# EAGLE design MBC1_1-4 (EAGLE 9.6.2)
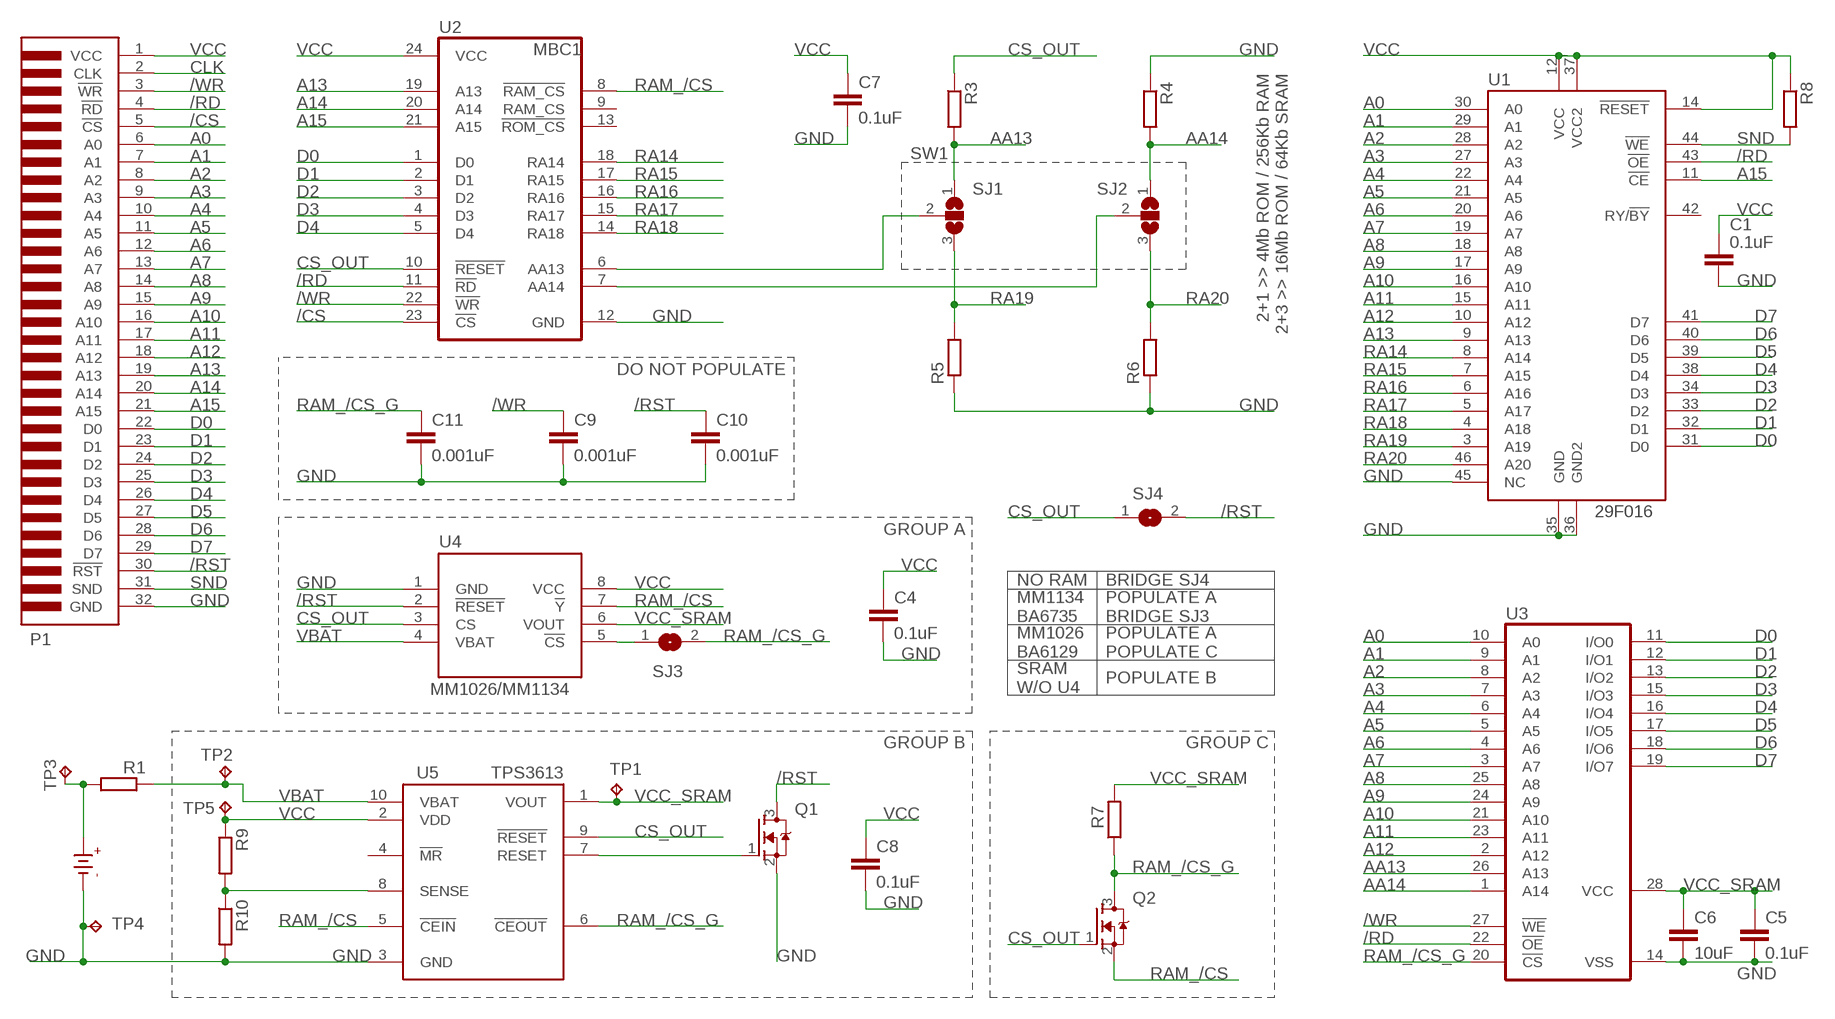
[diagram p0: schematic, sheet 1]

## Parts
B1  CR2025  [CR2025]
C1  0.1uF  C-EUC0603  [C0603]
C4  0.1uF  C-EUC0603  [C0603]
C5  0.1uF  C-EUC0603  [C0603]
C6  10uF  C-EUC0603  [C0603]
C7  0.1uF  C-EUC0603  [C0603]
C8  0.1uF  C-EUC0603  [C0603]
C9  0.001uF  C-EUC0603  [C0603]
C10  0.001uF  C-EUC0603  [C0603]
C11  0.001uF  C-EUC0603  [C0603]
P1  GBC_CARTTAB  [GBC_CART_TABBED]
Q1  2N7002  MOSFET-NREFLOW  [SOT23]
Q2  2N7002  MOSFET-NREFLOW  [SOT23]
R1  RR0603  [R0603]
R3  RR0603  [R0603]
R4  RR0603  [R0603]
R5  RR0603  [R0603]
R6  RR0603  [R0603]
R7  RR0603  [R0603]
R8  RR0603  [R0603]
R9  RR0603  [R0603]
R10  RR0603  [R0603]
SJ1  SJ2W  [SJ_2]
SJ2  SJ2W  [SJ_2]
SJ3  SJ  [SJ]
SJ4  SJ  [SJ]
TP1  TPB1,27  [B1,27]
TP2  TPB1,27  [B1,27]
TP3  TPB1,27  [B1,27]
TP4  TPB1,27  [B1,27]
TP5  TPB1,27  [B1,27]
U1  29F016  [TSOP-48]
U2  MBC1  [SOP-24]
U3  62256_SRAM  [SOP-28L]
U4  MM1134  [SOIC-8]
U5  TPS3613  [MSOP-10]

## Nets
/CS: P1.5(!CS) U2.23(!CS)
/RD: P1.4(!RD) U1.43(!OE) U2.11(!RD) U3.22(!OE)
/RST: C10.1 P1.30(!RST) Q1.3(D) SJ4.2 U4.2(!RESET)
/WR: C9.1 P1.3(!WR) U2.22(!WR) U3.27(!WE)
A0: P1.6(A0) U1.30(A0) U3.10(A0)
A1: P1.7(A1) U1.29(A1) U3.9(A1)
A2: P1.8(A2) U1.28(A2) U3.8(A2)
A3: P1.9(A3) U1.27(A3) U3.7(A3)
A4: P1.10(A4) U1.22(A4) U3.6(A4)
A5: P1.11(A5) U1.21(A5) U3.5(A5)
A6: P1.12(A6) U1.20(A6) U3.4(A6)
A7: P1.13(A7) U1.19(A7) U3.3(A7)
A8: P1.14(A8) U1.18(A8) U3.25(A8)
A9: P1.15(A9) U1.17(A9) U3.24(A9)
A10: P1.16(A10) U1.16(A10) U3.21(A10)
A11: P1.17(A11) U1.15(A11) U3.23(A11)
A12: P1.18(A12) U1.10(A12) U3.2(A12)
A13: P1.19(A13) U1.9(A13) U2.19(A13)
A14: P1.20(A14) U2.20(A14)
A15: P1.21(A15) U1.11(!CE) U2.21(A15)
AA13: R3.2 SJ1.1 U3.26(A13)
AA14: R4.2 SJ2.1 U3.1(A14)
CLK: P1.2(CLK)
CS_OUT: Q2.1(G) R3.1 SJ4.1 U2.10(!RESET) U4.3(CS) U5.9(!RESET)
D0: P1.22(D0) U1.31(D0) U2.1(D0) U3.11(I/O0)
D1: P1.23(D1) U1.32(D1) U2.2(D1) U3.12(I/O1)
D2: P1.24(D2) U1.33(D2) U2.3(D2) U3.13(I/O2)
D3: P1.25(D3) U1.34(D3) U2.4(D3) U3.15(I/O3)
D4: P1.26(D4) U1.38(D4) U2.5(D4) U3.16(I/O4)
D5: P1.27(D5) U1.39(D5) U3.17(I/O5)
D6: P1.28(D6) U1.40(D6) U3.18(I/O6)
D7: P1.29(D7) U1.41(D7) U3.19(I/O7)
GND [GND]: B1.- C1.2 C4.2 C5.2 C6.2 C7.2 C8.2 C9.2 C10.2 C11.2 P1.32(GND) Q1.2(S) R4.1 R5.1 R6.1 R10.2 TP4.TP U1.35(GND) U1.36(GND2) U1.45(NC) U2.12(GND) U3.14(VSS) U4.1(GND) U5.3(GND)
N$1: SJ2.2 U2.7(AA14)
N$2: SJ1.2 U2.6(AA13)
N$3 [VCC]: B1.+ R1.2 TP3.TP
N$4: SJ3.1 U4.5(!CS)
N$6: Q1.1(G) U5.7(RESET)
N$7: R9.2 R10.1 U5.8(SENSE)
RA14: U1.8(A14) U2.18(RA14)
RA15: U1.7(A15) U2.17(RA15)
RA16: U1.6(A16) U2.16(RA16)
RA17: U1.5(A17) U2.15(RA17)
RA18: U1.4(A18) U2.14(RA18)
RA19: R5.2 SJ1.3 U1.3(A19)
RA20: R6.2 SJ2.3 U1.46(A20)
RAM_/CS: Q2.2(S) U2.8(!RAM_CS) U4.7(!Y) U5.5(!CEIN)
RAM_/CS_G: C11.1 Q2.3(D) R7.1 SJ3.2 U3.20(!CS) U5.6(!CEOUT)
SND: P1.31(SND) R8.2 U1.44(!WE)
VBAT [VCC]: R1.1 TP2.TP U4.4(VBAT) U5.10(VBAT)
VCC [VCC]: C1.1 C4.1 C7.1 C8.1 P1.1(VCC) R8.1 R9.1 TP5.TP U1.12(VCC) U1.14(!RESET) U1.37(VCC2) U2.24(VCC) U4.8(VCC) U5.2(VDD)
VCC_SRAM [VCC]: C5.1 C6.1 R7.2 TP1.TP U3.28(VCC) U4.6(VOUT) U5.1(VOUT)
Unconnected: U1.42(RY/!BY) U2.9(RAM_CS) U2.13(!ROM_CS) U5.4(!MR)

## Notes on the sheet
- 2+1 >> 4Mb ROM / 256Kb RAM
  2+3 >> 16Mb ROM / 64Kb SRAM
- SW1
- DO NOT POPULATE
- GROUP A
- NO RAM | BRIDGE SJ4
- MM1134
  BA6735
- POPULATE A
  BRIDGE SJ3
- MM1026
  BA6129
- POPULATE A
  POPULATE C
- SRAM
  W/O U4
- POPULATE B
- MM1026/MM1134
- GROUP B | GROUP C

## Library data of the parts
B1 = gameboylib:CR2025
C1 C4-C11 = rcl:C-EU: CAPACITOR, European symbol; SPICEPREFIX: C
P1 = gameboylib:GBC_CART
Q1 Q2 = adafruit:MOSFET-N: N-Channel Mosfet 2N7002E - 60V 260mA SOT23 [Digikey: 2N7002ET1GOSTR-ND] - REEL BSH103 - 30V 850mA SOT23 [Digikey: 568-5013-1-ND]
R1 R3-R10 = eagle-ltspice:R: RESISTOR, European symbol; SPICEMODEL: NONE; SPICEPREFIX: R
SJ1 SJ2 = jumper:SJ2W: SMD solder JUMPER
SJ3 SJ4 = jumper:SJ: SMD solder JUMPER
TP1-TP5 = testpad:TP: Test pad
U1 = gameboylib:29F016
U2 = gameboy:MBC1: MBC1; OC_FARNELL: unknown; OC_NEWARK: unknown
U3 = gameboylib:62256_SRAM: MEMORY; MPN: CY62256VNLL-70SNXI; OC_FARNELL: 1650073; OC_NEWARK: 19M2582
U4 = gameboylib:MM1134
U5 = gameboylib:TPS3613

## Net classes
1 VCC: width 0.203 mm
2 GND: width 0.203 mm

## Board
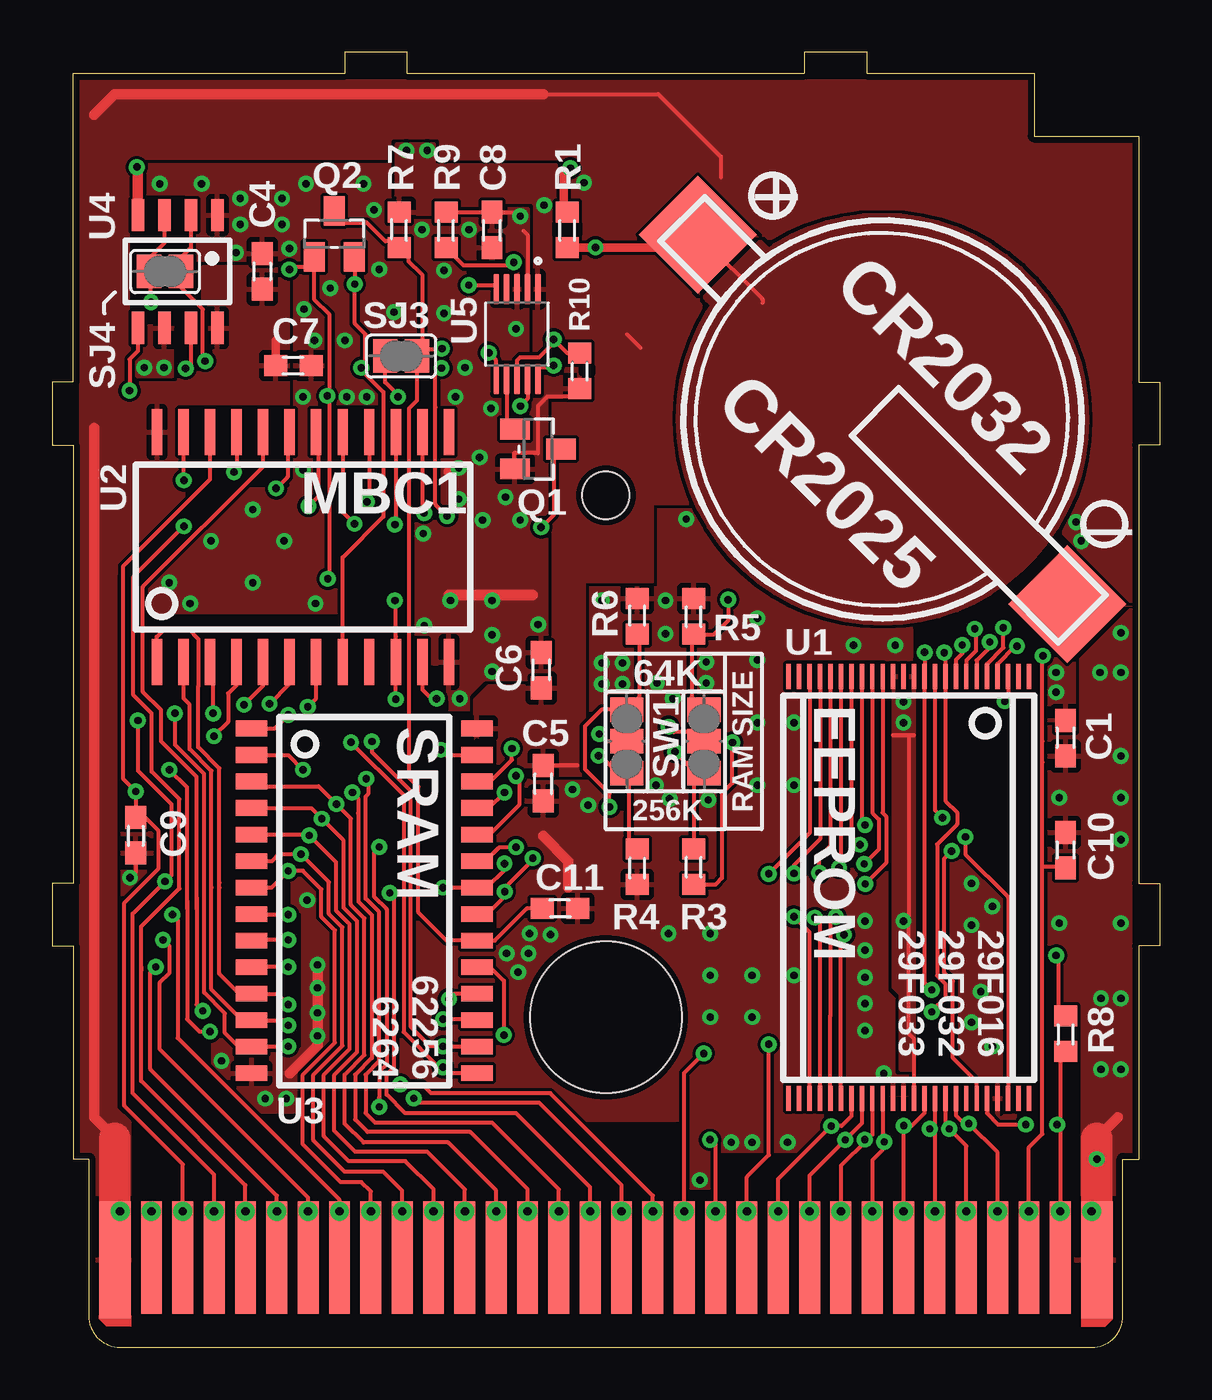
[diagram p1: board, top side]
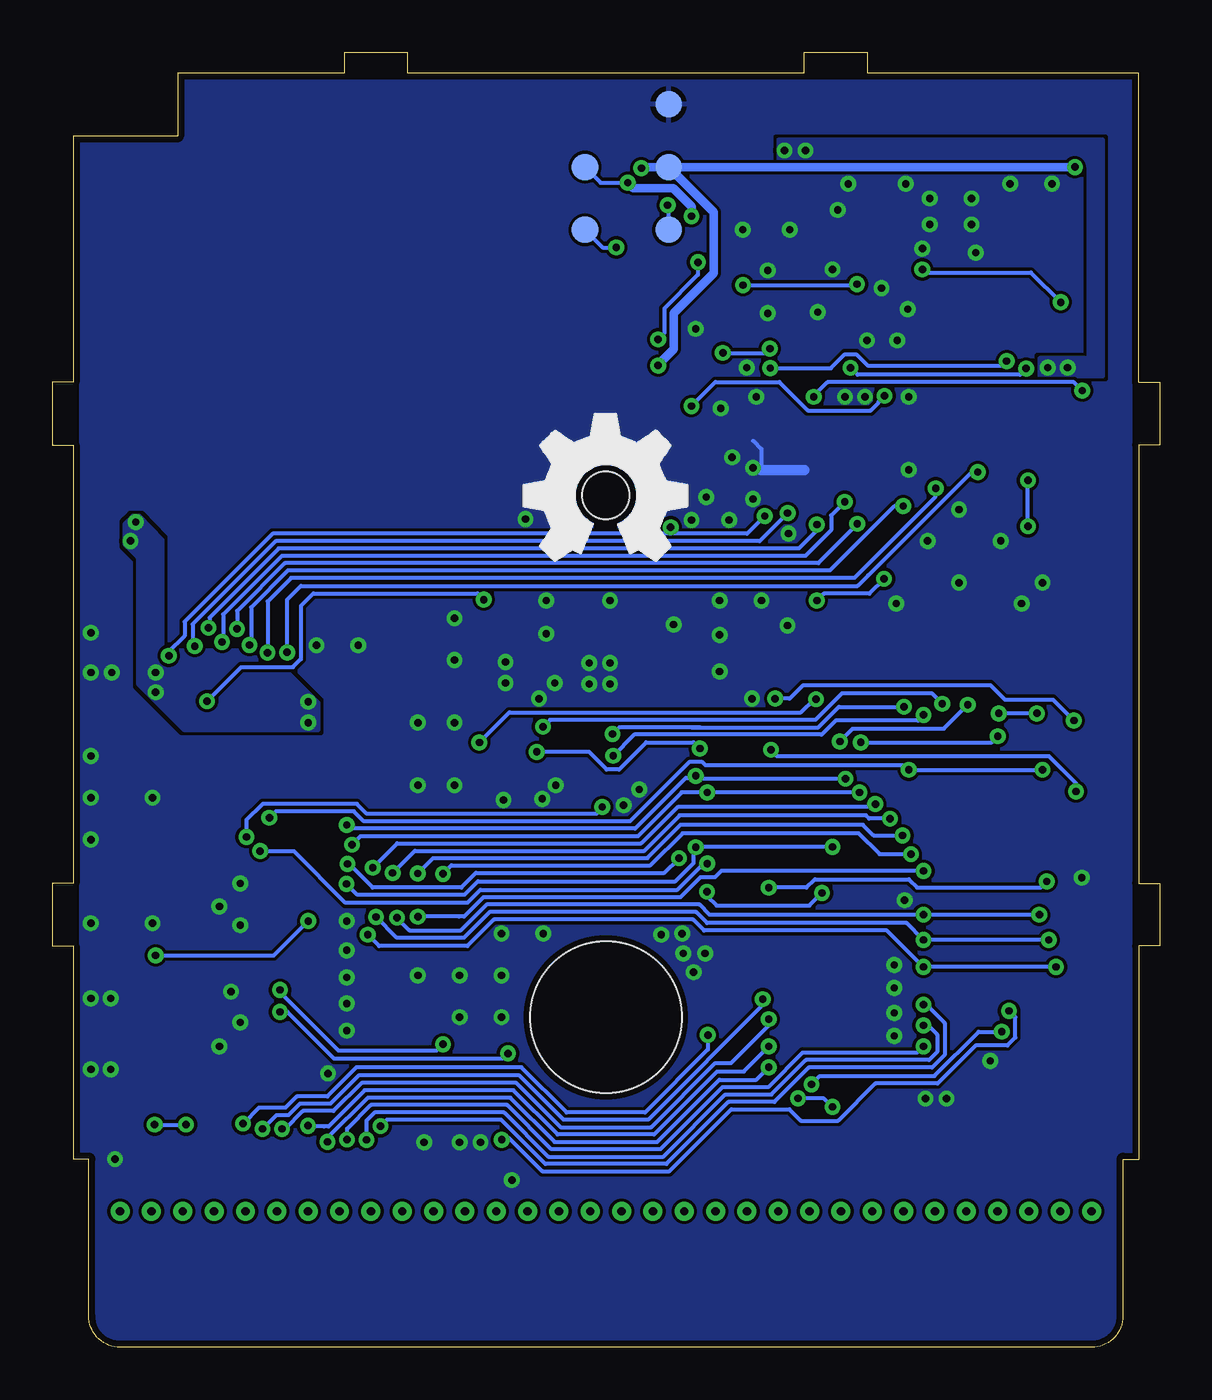
[diagram p2: board, bottom side, seen from below]

Size 53 x 62.01 mm. Coordinates in mm from the lower left corner, seen from the top.
Copper layers (1*16): Top 0.035mm / dielectric 1.5mm / Bottom 0.035mm
Design rules "default *": minimum track width 7mil, minimum drill 13mil, track to track 6mil, track to pad 7mil, pad to pad 7mil, via to via 7mil, smd to smd 5mil, copper to edge 12mil, drill to drill 22mil, minimum pad ring 10mil, minimum via ring 8mil, stop-mask expansion 4mil, vias tented up to drill 14mil, thermal gap 10mil
tKeepout: area -0.8,-1.6 to 55,11.5; area 0,11 to 3,62; area 50,11 to 53,62; area 3,55 to 50,62
tRestrict: area 4.6,34.6 to 14.7,35; area 31.8,8.7 to 35.9,9.2; area 47.6,15.6 to 49,16.2; area 48.9,14.3 to 49.1,15.7; area 48.4,5.5 to 49.1,13.9; area 11.2,14.4 to 11.8,20.7; area 10.6,21 to 11.3,22.4; area 18.8,29.3 to 19.9,30.4; area 35.1,12.1 to 40,12.6; area 35.2,32.3 to 39.8,32.8; area 39.8,11.2 to 41.2,11.9; area 47.6,0.7 to 50.9,1.2; area 20.3,19.9 to 21.1,29.1; area 6,44.7 to 11.3,45; area 8.9,41.3 to 11.2,41.8; area 27.6,6.7 to 35.7,7.5; area 13.7,44.4 to 15.4,45; area 17.5,29.7 to 18.9,31; area 9.8,10.3 to 11.9,11.1; area 6.7,13.5 to 7.5,14.6; area 18.1,31.8 to 18.6,32.6; area 4.5,54.5 to 6.3,55.1; area 25.3,10.2 to 29.9,10.7; area 25.3,46.6 to 25.9,47; area 24,53.3 to 25.3,53.8; area 41.3,33 to 48.9,38.9; area 10.9,60.8 to 42.9,61.3; area 0.7,15 to 1.2,47; area 51.8,14.7 to 52.3,46.7
bRestrict: area 26,39.3 to 27,39.5; area 51.8,14.7 to 52.3,46.7; area 0.7,15 to 1.2,47; area 10.9,60.8 to 42.9,61.3

### Footprints (pad centres in the part's own frame; a part is rotated, then mirrored left to right if it is on the bottom)
CR2025 = smd 4 x 4: + -12,0; - 13,0
C0603 = smd 1.1 x 1: 1 -0.85,0; 2 0.85,0
GBC_CART_TABBED = smd 1.5 x 5.6: 1 -23.4,-25.01; 32 23.6,-25.01 | smd 1 x 5.4: 2 -21.65,-24.91; 3 -20.15,-24.91; 4 -18.65,-24.91; 5 -17.15,-24.91; 6 -15.65,-24.91; 7 -14.15,-24.91; 8 -12.65,-24.91; 9 -11.15,-24.91; 10 -9.65,-24.91; 11 -8.15,-24.91; 12 -6.65,-24.91; 13 -5.15,-24.91; 14 -3.65,-24.91; 15 -2.15,-24.91; 16 -0.65,-24.91; 17 0.85,-24.91; 18 2.35,-24.91; 19 3.85,-24.91; 20 5.35,-24.91; 21 6.85,-24.91; 22 8.35,-24.91; 23 9.85,-24.91; 24 11.35,-24.91; 25 12.85,-24.91; 26 14.35,-24.91; 27 15.85,-24.91; 28 17.35,-24.91; 29 18.85,-24.91; 30 20.35,-24.91; 31 21.85,-24.91 | drill 0.4: P$1 -21.65,-22.7; P$2 -18.65,-22.7; P$3 -15.65,-22.7; P$4 -12.65,-22.7; P$5 -9.65,-22.7; P$6 -6.65,-22.7; P$7 -3.65,-22.7; P$8 -0.65,-22.7; P$9 2.35,-22.7; P$10 5.35,-22.7; P$11 8.35,-22.7; P$12 11.35,-22.7; P$13 14.35,-22.7; P$14 17.35,-22.7; P$15 20.35,-22.7; P$16 23.35,-22.7; P$17 21.85,-22.7; P$18 18.85,-22.7; P$19 15.85,-22.7; P$20 12.85,-22.7; P$21 9.85,-22.7; P$22 6.85,-22.7; P$23 3.85,-22.7; P$24 0.85,-22.7; P$25 -2.15,-22.7; P$26 -5.15,-22.7; P$27 -8.15,-22.7; P$28 -11.15,-22.7; P$29 -14.15,-22.7; P$30 -17.15,-22.7; P$31 -20.15,-22.7; P$32 -23.15,-22.7 | hole 7.25: 0.1,-13.41 | hole 2.25: 0.1,11.585
SOT23 = smd 1 x 1.4: 1 -0.95,-1.1; 2 0.95,-1.1; 3 0,1.1
R0603 = smd 1 x 1.1: 1 -0.85,0; 2 0.85,0
SJ_2 = smd 1.168 x 1.6: 1 -1.524,0; 2 0,0; 3 1.524,0
SJ = smd 1.168 x 1.6: 1 -0.762,0; 2 0.762,0
B1,27 = smd 1.27 x 1.27: TP 0,0
TSOP-48 = smd 1.2 x 0.21: 1 -10.1,5.75; 2 -10.1,5.25; 3 -10.1,4.75; 4 -10.1,4.25; 5 -10.1,3.75; 6 -10.1,3.25; 7 -10.1,2.75; 8 -10.1,2.25; 9 -10.1,1.75; 10 -10.1,1.25; 11 -10.1,0.75; 12 -10.1,0.25; 13 -10.1,-0.25; 14 -10.1,-0.75; 15 -10.1,-1.25; 16 -10.1,-1.75; 17 -10.1,-2.25; 18 -10.1,-2.75; 19 -10.1,-3.25; 20 -10.1,-3.75; 21 -10.1,-4.25; 22 -10.1,-4.75; 23 -10.1,-5.25; 24 -10.1,-5.75; 25 10.1,-5.75; 26 10.1,-5.25; 27 10.1,-4.75; 28 10.1,-4.25; 29 10.1,-3.75; 30 10.1,-3.25; 31 10.1,-2.75; 32 10.1,-2.25; 33 10.1,-1.75; 34 10.1,-1.25; 35 10.1,-0.75; 36 10.1,-0.25; 37 10.1,0.25; 38 10.1,0.75; 39 10.1,1.25; 40 10.1,1.75; 41 10.1,2.25; 42 10.1,2.75; 43 10.1,3.25; 44 10.1,3.75; 45 10.1,4.25; 46 10.1,4.75; 47 10.1,5.25; 48 10.1,5.75
SOP-24 = smd 0.5 x 2.2: 1 -6.985,-5.5; 2 -5.715,-5.5; 3 -4.445,-5.5; 4 -3.175,-5.5; 5 -1.905,-5.5; 6 -0.635,-5.5; 7 0.635,-5.5; 8 1.905,-5.5; 9 3.175,-5.5; 10 4.445,-5.5; 11 5.715,-5.5; 12 6.985,-5.5; 13 6.985,5.5; 14 5.715,5.5; 15 4.445,5.5; 16 3.175,5.5; 17 1.905,5.5; 18 0.635,5.5; 19 -0.635,5.5; 20 -1.905,5.5; 21 -3.175,5.5; 22 -4.445,5.5; 23 -5.715,5.5; 24 -6.985,5.5
SOP-28L = smd 0.75 x 1.5: 1 -7.62,-5.457; 2 -6.35,-5.457; 3 -5.08,-5.457; 4 -3.81,-5.457; 5 -2.54,-5.457; 6 -1.27,-5.457; 7 0,-5.457; 8 1.27,-5.457; 9 2.54,-5.457; 10 3.81,-5.457; 11 5.08,-5.457; 12 6.35,-5.457; 13 7.62,-5.457; 14 8.89,-5.457; 15 8.89,5.33; 16 7.62,5.33; 17 6.35,5.33; 18 5.08,5.33; 19 3.81,5.33; 20 2.54,5.33; 21 1.27,5.33; 22 0,5.33; 23 -1.27,5.33; 24 -2.54,5.33; 25 -3.81,5.33; 26 -5.08,5.33; 27 -6.35,5.33; 28 -7.62,5.33
SOIC-8 = smd 0.6 x 1.55: 1 1.905,2.7; 2 0.635,2.7; 3 -0.635,2.7; 4 -1.905,2.7; 5 -1.905,-2.7; 6 -0.635,-2.7; 7 0.635,-2.7; 8 1.905,-2.7
MSOP-10 = smd 1.47 x 0.28: 1 -2.15,1; 2 -2.15,0.5; 3 -2.15,0; 4 -2.15,-0.5; 5 -2.15,-1; 6 2.15,-1; 7 2.15,-0.5; 8 2.15,0; 9 2.15,0.5; 10 2.15,1

### Placement (x,y rotation side)
B1  39.39,44.79 315 top
C1  48.5,29.16 270 top
C4  10.05,51.51 90 top
C5  23.5,27.01 270 top
C6  23.4,32.41 90 top
C7  11.55,47.01 0 top
C8  21.05,53.51 270 top
C9  4,24.51 270 top
C10  48.5,23.81 90 top
C11  24.3,21.01 0 top
P1  26.4,29.21 0 top
Q1  23.25,43.01 270 top
Q2  13.5,53.31 0 top
R1  24.65,53.51 270 top
R3  30.7,23.01 90 top
R4  28,23.01 90 top
R5  30.7,35.01 270 top
R6  28,35.01 270 top
R7  16.6,53.51 90 top
R8  48.5,15.01 270 top
R9  18.85,53.51 270 top
R10  25.25,46.76 270 top
SJ1  31.2,29.01 90 top
SJ2  27.5,29.01 90 top
SJ3  16.7,47.46 0 top
SJ4  5.4,51.51 0 top
TP1  23.5,53.51 0 bottom
TP2  23.5,56.51 0 bottom
TP3  27.5,53.51 0 bottom
TP4  23.5,59.51 0 bottom
TP5  27.5,56.51 0 bottom
U1  41,22.01 270 top
U2  12,38.31 0 top
U3  15,22.01 270 top
U4  6,51.51 0 top
U5  22.25,48.51 270 top

### Tracks (layer width: path | path; a pad name or v marks a point on that pad's centre or on a via)
/CS  (via drill 0.35)
  Top 0.2: P1.5 9.25,7.76 4.8,12.21 | v6.3,39.31 3.89,36.9 3.89,31.22 4.76,30.35 | v6.3,41.51 6.3,43.8 U2.23 | 4.25,18.01 4.25,20.14 6.08,21.97 6.08,26.24 4.76,27.57
  Top 0.203: 4.8,12.21 4.25,12.76 4.25,18.01 4.25,18.23 | 4.76,27.57 4.76,30.35
  Bottom 0.2: v6.3,39.31 v6.3,41.51
/RD  (via drill 0.35)
  Top 0.2: P1.4 7.75,8.26 3.85,12.16 3.85,20.76 v5.4,22.31 5.7,22.61 5.7,26.01 4.1,27.61 v4.1,30.01 | v18.7,22.01 U3.22 20.8,22.01 21.65,22.86 v21.65,23.16 | U2.11 17.71,31.5 18.15,31.06 v18.4,31.06 | v43.05,23.76 42.7,23.42 42.7,17.93 43.11,17.53 43.11,13.85 44.25,12.71
  Top 0.203: U1.43 44.25,12.71
  Bottom 0.2: v18.7,22.01 16.9,22.01 16.5,22.41 12,22.41 11.6,22.01 5.7,22.01 v5.4,22.31 | v4.1,30.01 5.1,31.01 7.4,31.01 8.1,31.71 17.05,31.71 17.7,31.06 v18.4,31.06 | v43.05,23.76 41.45,23.76 38.97,21.28
  Bottom 0.203: v21.65,23.16 21.83,23.16 23.08,21.91 32.51,21.91 33.13,21.28 35.23,21.28 35.77,21.28 38.97,21.28
/RST  (via drill 0.35)
  Top 0.2: 47.39,28.01 47.39,10.21 46.75,9.57 P1.30 | 47.39,23.01 47.39,29.01 47.39,33.09 v47.42,33.11 | U4.2 6.63,52.64 6.08,52.09 6.08,51.43 6.08,50.83 7.21,49.7 7.21,47.32 v7.32,47.22 | 18.34,45 18.34,46.59 v18.63,46.88
  Top 0.203: 47.39,28.01 47.39,29.01 | C10.1 48.5,23.01 47.39,23.01 | SJ4.2 6.08,51.43 6.07,51.41 | U4.2 6.6,54.21 | v18.9,39.8 18.34,40.35 18.34,45 | Q1.3 24.15,43.01 24,42.86 24,39.86 v23.4,39.26
  Bottom 0.2: v18.63,46.88 15.73,46.88 15.06,47.55 14.52,47.55 13.97,47.01 7.53,47.01 v7.32,47.22 | v18.9,39.8 19.75,38.95 23.4,38.95 | 23.4,38.95 42.46,38.95 46.67,34.74 46.67,34.06 47.42,33.31 v47.42,33.11 | v23.4,39.26 23.4,38.95
  Bottom 0.203: 23.4,38.96 v23.4,39.26
/WR  (via drill 0.35)
  Top 0.2: P1.3 6.25,8.76 3.45,11.56 3.45,21.29 5.1,22.94 5.1,24.71 4.45,25.36 C9.1 v4,26.61 3.4,27.21 3.4,37.41 7.55,41.56 U2.22 | v18.6,28.61 18.85,28.36 U3.27
  Bottom 0.2: v18.6,28.61 18.3,28.31 5.3,28.31 4,27.01 v4,26.61
A0  (via drill 0.35)
  Top 0.2: P1.6 10.75,7.26 4.7,13.31 4.7,17.95 v4.96,18.21 | v11.3,18.21 9.8,18.21 U3.10 | 37.75,19.6 v37.9,19.75
  Top 0.203: U1.30 37.75,19.6
  Bottom 0.2: v4.96,18.21 v11.3,18.21
  Bottom 0.203: v11.3,18.21 13.04,19.95 21.8,19.95 22.33,20.48 31.86,20.48 33.13,19.21 37.36,19.21 v37.9,19.75
A1  (via drill 0.35)
  Top 0.2: P1.7 12.25,7.16 5.7,13.71 | v11.3,19.51 9.83,19.51 U3.9 | v37.5,20.61 37.24,20.35 37.24,15.88
  Top 0.203: 5.7,13.71 5.15,14.26 5.15,17.48 5.61,17.94 5.61,19.2 v5.3,19.51 | U1.29 37.25,15.88 37.24,15.88
  Bottom 0.2: v5.3,19.51 v11.3,19.51 | 36.5,19.61 v37.5,20.61
  Bottom 0.203: v11.3,19.51 12.1,20.31 21.65,20.31 22.18,20.84 32.07,20.84 33.3,19.61 36.5,19.61
A2  (via drill 0.35)
  Top 0.2: P1.8 13.75,7.06 6,14.81 6,20.46 v5.75,20.71 | v11.3,20.71 9.82,20.71 U3.8 | 36.75,20.38 36.56,20.57 v36.5,20.57
  Top 0.203: U1.28 36.75,20.38
  Bottom 0.2: v5.75,20.71 v11.3,20.71 21.53,20.71 | v36.5,20.57 35.9,19.97 33.44,19.97
  Bottom 0.203: 33.44,19.97 32.21,21.19 22.02,21.19 21.53,20.71
A3  (via drill 0.35)
  Top 0.2: P1.9 15.25,7.46 14.8,7.91 13.8,7.91 12,9.71 12,13.05 13.53,14.58 13.53,19.96 12.89,20.61 12.89,21.92 12,22.81 v11.3,22.81 10.5,22.01 U3.7 | v35.5,20.62 36.06,20.07
  Top 0.203: U1.27 36.25,19.87 36.06,20.07
  Bottom 0.2: v11.3,22.81 20.9,22.81 | 33.54,20.62 v35.5,20.62 | 20.97,22.81 21.28,22.5 21.98,22.5 22.94,21.55 32.36,21.55
  Bottom 0.203: 20.9,22.81 20.97,22.81 | 32.36,21.55 33.29,20.62 33.54,20.62
A4  (via drill 0.35)
  Top 0.2: P1.10 16.75,7.5 15.84,8.41 14,8.41 12.5,9.91 12.5,13.05 13.89,14.43 13.89,20.11 13.24,20.75 13.24,22.27 v11.9,23.61 10.85,23.61 10.52,23.28 U3.6 | v34.3,22.67 36.25,24.62 U1.22
  Bottom 0.2: v11.9,23.61 13.4,23.61 14.4,24.61 22.83,24.61 24.37,23.07 33.9,23.07 v34.3,22.67
A5  (via drill 0.35)
  Top 0.2: P1.11 18.25,7.56 16.9,8.91 14.2,8.91 13,10.11 13,13.05 14.24,14.29 14.24,20.25 13.59,20.9 13.59,23.22 v12.3,24.51 12.26,24.55 U3.5 | v35.51,22.69 35.51,23.09 36.72,24.3 36.75,24.33 U1.21
  Bottom 0.2: v12.3,24.51 13.7,24.51 14.2,25.01 22.93,25.01 24.52,23.42 34.77,23.42 v35.51,22.69
A6  (via drill 0.35)
  Top 0.2: P1.12 19.75,7.56 17.95,9.36 14.5,9.36 13.5,10.36 13.5,13.05 14.59,14.14 14.59,20.4 13.94,21.05 13.94,24.27 v12.9,25.31 12.39,25.82 U3.4 | v36.71,22.71 36.71,23.46 37.13,23.88 37.25,24 U1.20
  Bottom 0.2: v12.9,25.31 13.9,25.31 14.06,25.47 22.97,25.47 24.66,23.78 35.64,23.78 v36.71,22.71
A7  (via drill 0.35)
  Top 0.2: P1.13 21.25,7.51 18.95,9.81 14.9,9.81 14,10.71 14,13.05 14.94,14 14.94,20.54 14.29,21.19 14.29,25.32 v13.6,26.01 12.75,26.86 9.77,26.86 U3.3 | v37.66,22.96 37.75,23.05 U1.19
  Bottom 0.2: v13.6,26.01 13.74,25.87 23.07,25.87 24.81,24.13 36.49,24.13 v37.66,22.96
A8  (via drill 0.35)
  Top 0.2: P1.14 22.75,7.56 20,10.31 15.1,10.31 14.5,10.91 14.5,13.05 15.29,13.85 15.29,20.69 14.65,21.34 14.65,25.56 14.65,26.29 v14.37,26.57 | U3.25 20.9,25.82 v21.65,26.57 | v38.66,24.06 38.25,24.47 U1.18
  Bottom 0.2: 21,26.57 22.87,26.57 24.95,24.48 38.23,24.48 v38.66,24.06
  Bottom 0.203: v14.37,26.57 21,26.57 v21.65,26.57
A9  (via drill 0.35)
  Top 0.2: P1.15 24.25,7.56 21.05,10.76 15.45,10.76 | U3.24 20.94,24.55 22.35,25.96 22.35,27.21 v22.2,27.36 | v38.91,25.01 38.75,25.17 U1.17 | 15,11.24 15,13.06 15.65,13.7 15.65,20.84 15,21.48 15,26.01
  Top 0.203: 15,25.71 15,26.01 15,26.37 15.12,26.49 15.12,27.13 v15.03,27.22 | 15,11.24 15,11.21 15.45,10.76
  Bottom 0.2: v22.2,27.36 22.3,27.26 22.67,27.26 25.1,24.83 38.73,24.83 v38.91,25.01
  Bottom 0.203: v15.03,27.22 22.06,27.22 v22.2,27.36
A10  (via drill 0.35)
  Top 0.2: P1.16 25.75,7.66 22.2,11.21 16.9,11.21 16,12.11 16,13.06 16.36,13.42 16.36,21.55 v16.16,21.75 | U3.21 20.09,20.75 20.82,20.75 21.66,21.6 | v23,23.42 23,23.13 22.8,23.13 21.62,21.95 | v38.86,23.15 39.56,23.85 39.56,25.28 39.25,25.59 U1.16
  Top 0.203: 21.62,21.95 v21.66,21.82 21.66,21.6
  Bottom 0.2: v23,23.42 23.7,22.72 32.72,22.72 33.42,22.02 37.66,22.02 38.79,23.15 v38.86,23.15
  Bottom 0.203: v16.16,21.75 16.76,21.15 21.2,21.15 21.66,21.62 v21.66,21.82
A11  (via drill 0.35)
  Top 0.2: P1.17 27.25,7.76 23.3,11.71 17.51,11.71 v17.31,11.92 | U3.23 20.74,23.28 21.38,23.92 | v38.92,22.18 39.91,23.18 39.91,25.43 39.75,25.59 U1.15 | v15.66,23.95 15.66,23.93 15.4,23.68 15.4,21.58 16,20.98 16,13.56 15.65,13.21 15.65,11.96 15.66,11.96 v15.66,11.51
  Top 0.203: v22.2,23.94 21.4,23.94 20.74,23.28 U3.23
  Bottom 0.2: v15.66,11.51 16.06,11.92 v17.31,11.92 | v38.92,22.18 38.4,21.66 33.27,21.66 32.62,22.32 23.17,22.32 22.31,23.18 22.31,23.68 22.2,23.79 v22.2,23.94
  Bottom 0.203: v15.66,23.95 v15.66,23.96 22.19,23.96 v22.2,23.94
A12  (via drill 0.35)
  Top 0.2: P1.18 28.75,7.26 23.85,12.16 18.13,12.16 17.7,12.59 v16.66,12.59 | v7.56,15.11 7.06,15.11 | U3.2 11.29,28.36 v12,27.65 | v42.61,25.36 42.25,25.72 U1.10 | v5.61,27.65 6.45,26.81 6.45,21.01
  Top 0.203: 7.06,15.11 6.45,15.71 6.45,21.01 6.45,21.39
  Bottom 0.2: v16.66,12.59 16.26,12.99 10.78,12.99 8.66,15.11 v7.56,15.11 | 12.23,27.88 v12,27.65 v5.61,27.65 | 25.35,25.19 22.52,28.02 21.88,28.02
  Bottom 0.203: 21.88,28.02 21.74,27.88 12.23,27.88 | v42.61,25.36 42.3,25.67 38.56,25.67 38.08,25.19 25.35,25.19
A13  (via drill 0.35)
  Top 0.2: P1.19 30.25,13.13 v31.18,14.07 | v42.1,16.06 42.1,16.1 42.76,16.75 42.76,17.38 42.35,17.79 42.35,24.09 43.31,25.04 43.31,25.61 42.75,26.17 U1.9 42.75,33.2
  Top 0.203: v10.71,41.12 11.27,41.67 11.27,43.21 11.37,43.31 U2.19 | v42.69,33.26 42.75,33.2
  Bottom 0.2: v31.18,14.07 31.44,13.81 39.5,13.81 41.75,16.06 v42.1,16.06 | 10.71,40.75 14.62,36.84 41.57,36.84 42.69,35.72 v42.69,33.26
  Bottom 0.203: 10.71,40.75 v10.71,41.12
A14  (via drill 0.35)
  Top 0.2: 6.91,16.41 v7.21,16.11 | 5.21,30.51 5.21,29.01 6.91,27.32 6.91,21.01
  Top 0.203: P1.20 31.75,9.94 v31.48,9.94 | 6.91,21.54 6.91,21.01 6.91,16.41 | 5.21,30.51 4.34,31.38 4.34,36.42 10.1,42.17 U2.20
  Bottom 0.2: 13.6,12.63 10.63,12.63 8.81,14.45 7.28,14.45 6.9,14.84 6.9,15.8 v7.21,16.11 | v31.48,9.94 31.41,10.01 31.13,10.01 29.54,8.43 23.46,8.43 20.49,11.4 17.71,11.4
  Bottom 0.203: 13.6,12.63 15.38,10.85 17.17,10.85 17.71,11.4
A15  (via drill 0.35)
  Top 0.2: P1.21 33.25,8.16 34.3,9.21 v34.3,14.51 | v42.1,17.11 41.75,17.46 U1.11 v41.76,33.27
  Top 0.203: U2.21 8.82,42.03 v8.7,41.91 | v41.75,33.26 v41.76,33.27
  Bottom 0.2: v42.1,17.11 42.1,17.01 39.3,14.21 34.6,14.21 v34.3,14.51 | v41.76,33.27 v41.75,33.28 41.75,35.8 41.1,36.45 14.45,36.45 13.95,36.96
  Bottom 0.203: 13.95,36.95 13.95,36.96 9,41.91 v8.7,41.91
AA13  (via drill 0.35)
  Top 0.2: v29.81,28.51 30.83,27.49 SJ1.1 30.7,26.99 R3.2
  Top 0.203: U3.26 20.97,27.09 22,28.12 v22,28.67
  Bottom 0.2: v22,28.67 22.29,28.97 24.57,28.97 25.87,27.67 26.46,27.67 27.31,28.51 v29.81,28.51
AA14  (via drill 0.35)
  Top 0.2: 26.26,28.32 27.1,27.49 SJ2.1
  Top 0.203: U3.1 10.65,29.63 v11.3,30.28 | SJ2.1 27.6,27.39 27.6,24.26 R4.2 | 26.26,28.32 v26.15,28.32
  Bottom 0.203: v11.3,30.28 11.57,30.01 15.5,30.01 16.18,29.33 25.14,29.33 v26.15,28.32
CS_OUT  (via drill 0.35)
  Top 0.2: U2.10 16.45,34.01 | 16.45,34.01 16.45,35.85 16.4,35.85 v16.4,35.75 | v13.18,36.79 13.27,36.79 13.27,45.51 | 13.27,45.51 13.27,49.44 12.55,50.16 12.55,51.96 | v16.44,31.03 16.44,34.01 16.45,34.01 | R3.1 31.75,22.16 32.06,22.47 32.06,26.51 32.56,27.01 v32.56,28.96 | U4.3 5.37,52.88 4.64,52.15 SJ4.1 | v4.73,50.04 4.71,50.06 4.71,51.44 | v11.35,51.61 11.45,51.71 12.3,51.71 12.55,51.96 | Q2.1 12.55,51.96 | U5.9 22.75,45.41 v22.41,45.07 | v13.17,45.55 13.23,45.55 13.27,45.51
  Top 0.203: 4.64,51.11 SJ4.1 4.71,51.44
  Bottom 0.2: v11.35,51.61 11.2,51.46 6.16,51.46 v4.73,50.04 | v16.44,31.03 16.53,31.03 17.16,30.4 31.12,30.4 v32.56,28.96 | v16.4,35.75 16.07,36.09 13.89,36.09 v13.18,36.79 | v22.41,45.07 21.26,46.22 18.19,46.22 16.83,44.85 13.83,44.85 13.44,45.24 13.44,45.28 v13.17,45.55
D0  (via drill 0.35)
  Top 0.2: U3.11 10.78,16.93 v11.3,16.41 | P1.22 34.75,8.06 v37.28,10.59 v37.29,10.59 37.78,10.59 38.25,11.06 | 6.99,31.65 6.98,31.65 | 6.99,31.65 6.99,28.74 8,27.72 8,22.01 | U2.1 5,32.83 5,34.01 5.4,34.41 6.5,34.41 7,33.91 7,31.66 6.99,31.65
  Top 0.203: U3.11 8.95,16.93 8,17.88 8,22.01 8,22.25 | 5.01,32.7 U2.1 | U1.31 38.25,11.06
  Bottom 0.2: v11.3,16.41 11.17,16.41 10.29,15.53 10.29,13.99 10.88,13.4 16.78,13.4 18.44,11.75 20.63,11.75 23.6,8.78 29.4,8.78 31.51,10.9 36.99,10.9 v37.29,10.59
D1  (via drill 0.35)
  Top 0.2: U3.12 11.05,15.66 v11.3,15.41 | P1.23 36.25,8.22 v37.96,9.93 v37.96,9.94 38.75,10.73 | 6.58,30.78 6.58,28.65 7.62,27.61 7.62,22.01
  Top 0.203: U3.12 9.09,15.66 7.62,17.13 7.62,22.01 7.62,22.03 | 6.58,30.78 6.29,31.07 U2.2 | U1.32 38.75,10.73
  Bottom 0.2: v11.3,15.41 11.07,15.41 10.64,14.98 10.64,14.14 11.03,13.75 16.93,13.75 18.58,12.1 20.78,12.1 23.75,9.13 29.25,9.13 31.37,11.25 37.56,11.25 37.95,10.86 37.95,9.95 v37.96,9.94
D2  (via drill 0.35)
  Top 0.2: P1.24 37.75,8.69 39,9.94 | U3.13 11.28,14.39 v11.3,14.41 | 39.25,10.19 39,9.94 | 39,9.94 v38.89,9.94 | v5.87,30.35 5.87,28.86 7.26,27.46 7.26,21.78
  Top 0.203: U3.13 8.92,14.39 8.27,15.04 8.27,15.98 7.26,16.98 7.26,21.78 | v7.7,30.35 7.7,32.81 U2.3 | U1.33 39.25,10.19
  Bottom 0.2: v11.3,14.41 11.6,14.11 17.07,14.11 18.73,12.45 20.93,12.45 23.9,9.48 29.1,9.48 31.22,11.6 37.75,11.6 38.89,10.46 v38.89,9.94
  Bottom 0.203: v5.87,30.35 v7.7,30.35
D3  (via drill 0.35)
  Top 0.2: U3.15 18.99,13.12 v18.7,13.41 | P1.25 39.25,8.96 39.75,9.46 39.75,9.91 v39.83,9.84 | 18.5,13.41 16.81,15.1 16.81,26.45
  Top 0.203: v18.7,13.41 18.5,13.41 | 16.81,26.45 v14.3,28.97 | v7.74,29.26 8.43,29.94 8.43,31.31 8.82,31.71 U2.4 | U1.34 39.75,9.91
  Bottom 0.2: v18.7,13.41 19.3,12.81 21.07,12.81 24.04,9.84 28.96,9.84 31.08,11.95 37.9,11.95 39.83,10.02 v39.83,9.84
  Bottom 0.203: v14.3,28.97 8.04,28.97 v7.74,29.26
D4  (via drill 0.35)
  Top 0.2: U3.16 18.72,14.39 v18.7,14.41
  Top 0.203: v18.7,14.41 18.1,14.41 17.17,15.34 17.17,26.64 15.3,28.51 v15.3,29.01 | v9.18,30.77 10.1,31.68 U2.5 | P1.26 v40.75,10.6 v40.76,10.61 41.15,10.61 41.75,11.21 U1.38
  Bottom 0.2: v18.7,14.41 19.9,13.21 21.17,13.21 24.19,10.19 28.81,10.19 30.93,12.31 38.04,12.31 | 38.04,12.31 | 38.04,12.31 39.77,10.58 40,10.58
  Bottom 0.203: v15.3,29.01 14.69,29.62 10.33,29.62 v9.18,30.77 | v40.76,10.61 40.73,10.58 40,10.58 39.77,10.58
D5  (via drill 0.35)
  Top 0.2: U3.17 20.03,15.71 v18.7,15.71
  Top 0.203: P1.27 42.25,10.21 v42,10.46 42.06,10.46 42.25,10.65 U1.39
  Bottom 0.2: v18.7,15.71 18.7,15.41 20.5,13.61 21.26,13.61 24.33,10.54 28.67,10.54 30.78,12.66 38.19,12.66 39.54,11.31 41,11.31 41.85,10.46 v42,10.46
D6  (via drill 0.35)
  Top 0.2: U3.18 19.25,16.93 v18.99,16.67 | 42.75,10.64 v42.93,10.46 43.75,9.64 P1.28
  Top 0.203: U1.40 42.75,10.64
  Bottom 0.2: v18.99,16.67 18.85,16.53 24.48,10.89 28.52,10.89 30.64,13.01 38.34,13.01 39.69,11.66 41.15,11.66 41.69,11.12 42.27,11.12 v42.93,10.46
D7  (via drill 0.35)
  Top 0.2: 45.23,4.92 45.25,4.9 P1.29 45.25,9.33 v43.87,10.71 43.65,10.71 43.25,11.11 | U3.19 20.97,18.2 21.62,17.55 v21.62,14.95
  Top 0.203: U1.41 43.25,11.11
  Bottom 0.2: v21.62,14.95 21.62,14.25 24.62,11.25 28.38,11.25 30.54,13.41 38.44,13.41 39.83,12.02 41.29,12.02 41.84,11.47 43.11,11.47 v43.87,10.71
GND  (via drill 0.35)
  Top 0.203: C9.2 4,22.77 v3.72,22.49 | R10.2 24.85,45.51 23.7,45.51 23.25,45.06 23.25,42.81 22.1,42.81 22.1,42.11 Q1.2
  Top 0.4: B1.- 48.8,35.57
  Top 0.5: 18.98,41.94 19.06,42.01 | 23,36.01 18.98,36.01 | 50,10.01 51,11.01 | 23.5,24.48 24.71,23.27 24.71,22.02 | v12.7,18.31 12.7,14.46 11.36,13.12
  Top 1.5: P1.32 50,10.01
  Bottom 0.203: 19.45,43.41 19.06,43.01 19.06,42.01
  Bottom 0.5: 19.06,42.01 17,42.01
  other vias: 21.75,18.86 9,53.76 8.8,52.41 9,55.01 12,42.01 9.6,40.11 7.6,38.61 5.6,36.61 9.6,36.61 11.1,38.61 19.06,35.76 21.06,35.76 21.06,34.11 21.06,32.36 22.85,19.81 12.2,21.41 12.7,17.21 12.7,16.01 12.7,14.91 8.1,13.71 10.2,11.91 11.2,11.91 29.5,19.81 31.5,19.81 31.5,17.81 31.5,15.81 33.5,15.81 33.5,17.81 35.5,17.81 32.5,9.81 33.5,9.81 51.15,32.31 51.15,28.31 51.15,24.31 51.15,20.31 51.15,16.71 51.15,13.31 50,9.01 50.2,13.31 50.2,16.71 48.2,20.31 38.9,17.71 38.9,19.01 38.9,20.41 35.5,26.91 35.5,29.91 12.05,49.71 12.6,35.61 6.6,35.61 22.3,17.96 22.8,18.86 23.85,19.76 45,14.41 44,22.21 44,20.21 44,15.56 25.65,25.96 31,8.01 35.2,9.81 38.9,15.16 48.2,26.31 33.75,26.91 33.75,29.91 29.35,34.16 27.3,31.76 27.3,32.76 29.35,35.76 33.75,32.91 40.35,33.61 50.15,32.31 51.15,34.21 51.15,26.31 19.46,40.61 39.8,13.11 28.95,31.81 31.3,32.81 12,45.51 14.1,45.51 15.05,45.51 17.81,34.56 19.51,31.06 23.26,34.61 19.31,45.51 18.76,49.51 16.36,49.56 14.01,48.21 14.9,55.71 5.15,55.71 7.15,55.71 20.46,42.61 26.3,32.76 26.3,31.76 28.9,26.91 31.4,26.21 17.76,38.96 15.4,54.46 17.7,53.51 19.95,53.51 22.2,48.76 21,44.96 21.7,40.71 22.4,39.61 20.6,39.61 19.46,42.11 12.56,48.21 13.31,50.71 19.76,46.91 18.76,51.56 15.66,51.61 12.15,55.71 11,55.01 11,53.76 11.35,52.61 24.9,26.71 29.7,31.06 31.3,31.81 29.55,26.26 44.44,17.03 45,21.11 38.9,16.46 30.35,39.66 38.35,33.61 33.75,34.91 26.3,35.76
  pour Bottom (rank 6): -2,63.01 61,63.01 61,-0.99 -3,-0.99 -3,62.01
  pour Top (rank 6): 1,62.01 60,62.01 60,-1.99 59,-2.99 -2,-2.99 -2,59.01
  pour Top: 39.85,32.51 39.85,34.11 38.2,34.11 38.2,32.51
N$1  (via drill 0.35)
  Top 0.203: v12.23,30.67 12.63,31.07 U2.7 | SJ2.2 26.54,29.01 v26.18,29.37
  Bottom 0.2: 22,29.69 25.86,29.69 v26.18,29.37
  Bottom 0.203: v12.23,30.67 v12.24,30.67 15.35,30.67 16.33,29.69 22,29.69 22.42,29.69
N$2  (via drill 0.35)
  Top 0.2: SJ1.2 30.75,29.46 29.76,29.46 v29.51,29.71
  Top 0.203: v10.4,30.81 11.37,31.78 U2.6
  Bottom 0.2: v29.51,29.71 29.17,30.04 22.57,30.04
  Bottom 0.203: 22.57,30.04 16.47,30.04 15.19,31.33 10.91,31.33 v10.4,30.81
N$3  (via drill 0.35)
  Top 0.203: B1.+ 31.08,53.09 34,50.18 34,50.01
  Top 0.4: R1.2 v26,52.66 27,52.66 27.18,52.66 30.35,52.66 31,52.01 31.08,52.09 31.08,53.09
  Bottom 0.203: TP3.TP 26.65,52.66 v26,52.66
  pour Top: 29.95,44.46 arc-90 39.72,54.24 arc-90 49.55,44.41 arc-90 39.77,34.64 arc-90
  pour Top: 30.85,50.73 30.85,50.64 31.35,50.14 32.65,48.84 33.5,48.84 35.3,50.64 35.3,51.21 35.3,51.56 34.12,52.73 32.85,54.01 30.35,54.01 30.35,51.23
N$4  (via drill 0.35)
  Top 0.2: U4.5 4.1,47.7 3.7,47.31 v3.7,45.81
  Top 0.203: v16.55,45.51 16.55,45.6 15.94,46.21 SJ3.1
  Bottom 0.2: v3.7,45.81 4.1,46.21 15.9,46.21 16.55,45.56 v16.55,45.51
N$6
  Top 0.2: U5.7 21.75,44.36 Q1.1
N$7  (via drill 0.35)
  Top 0.2: R9.2 19.71,51.8 21.94,51.8 v22.09,51.95 | R10.1 24.65,47.61 v24,48.26 24,48.11 23.3,47.41 22.4,47.41 22.25,47.26 U5.8
  Bottom 0.2: v22.09,51.95 22.09,51.35 23.7,49.74 23.7,48.56 v24,48.26
RA14  (via drill 0.35)
  Top 0.2: v43.56,33.62 43.56,33.22 43.25,32.91 U1.8
  Top 0.203: U2.18 12.63,43.31 12.73,43.21 12.73,40.75 v12.27,40.28
  Bottom 0.2: v43.56,33.62 43.48,33.7 43.48,35.42 41.72,37.19 15.77,37.19 12.69,40.28 v12.27,40.28
RA15  (via drill 0.35)
  Top 0.2: v44.15,34.4 44.21,34.34 44.21,33.35 43.94,33.07 43.75,32.89 U1.7
  Top 0.203: U2.17 13.9,39.99 v14.47,39.43
  Bottom 0.2: v14.47,39.43 14.47,39.41 16.33,37.54 41.87,37.54 44.15,35.26 v44.15,34.4
  Bottom 0.203: v14.47,39.43 14.5,39.43
RA16  (via drill 0.35)
  Top 0.2: v44.87,33.77 44.87,33.51 44.25,32.89 U1.6
  Top 0.203: U2.16 15.18,40.59 v15.07,40.48
  Bottom 0.2: v15.07,40.48 15.72,39.83 15.72,39.13 16.96,37.9 42.01,37.9 44.82,35.09 44.82,33.82 v44.87,33.77
  Bottom 0.203: v15.07,40.48 15.07,40.45
RA17  (via drill 0.35)
  Top 0.2: v45.52,34.45 45.53,34.44 45.53,33.5 44.75,32.72 U1.5
  Top 0.203: U2.15 16.45,39.44 v16.4,39.39
  Bottom 0.2: v45.52,34.45 45.47,34.49 45.47,34.94 42.16,38.25 17.27,38.25 16.4,39.12 v16.4,39.39
RA18  (via drill 0.35)
  Top 0.2: v46.18,33.57 46.1,33.57 45.25,32.73 U1.4
  Top 0.203: U2.14 17.71,40.03 v17.8,39.95
  Bottom 0.2: v46.18,33.57 46.28,33.67 46.28,34.63 42.31,38.6 19.14,38.6 v17.8,39.95
RA19  (via drill 0.35)
  Top 0.2: v45.59,30.94 45.75,31.1 U1.3 | v32.35,35.8 32.35,34.81 31.65,34.11 30.7,34.11 30.6,34.11
  Top 0.203: SJ1.3 30.6,31.13 30.6,34.11 | 30.7,34.11 R5.2
  Bottom 0.2: v45.59,30.94 43.96,32.57 41.49,32.57 41.1,32.95 41.1,35.5 40.5,36.1 32.65,36.1 v32.35,35.8
RA20  (via drill 0.35)
  Top 0.2: SJ2.3 26.3,30.53 26.3,30.54 25.49,29.73 25.49,27.7 | v43.71,24.44 43.71,23.6 45.75,21.56 U1.46
  Top 0.203: SJ2.3 28.1,31.13 28.1,34.06 R6.2 | v26.67,25.87 26.67,26.52 25.49,27.7
  Bottom 0.203: v26.67,25.87 26.67,25.82 26.95,25.54 37.94,25.54 38.42,26.02 42.92,26.02 43.71,25.24 v43.71,24.44
RAM_/CS  (via drill 0.35)
  Top 0.2: U2.8 13.9,37.82 15.85,39.77 15.85,45.74 14.74,46.85 v14.79,46.9 14.99,47.1 14.99,48.5 14.48,49.01 v14.48,50.91 | U4.7 6.63,47.12 v6.38,46.87 | U5.5 21.25,50.85 v19.94,50.85 | v14.48,50.91 14.5,50.92 | Q2.2 14.48,52.18 v14.48,50.91
  Bottom 0.2: v6.38,46.87 6.69,46.56 14.45,46.56 v14.79,46.9 | v19.94,50.85 14.54,50.85 v14.48,50.91
RAM_/CS_G  (via drill 0.35)
  Top 0.2: 17.1,44.98 17.1,27.26 17.52,26.84 17.52,20.81 18.86,19.47 U3.20 21.18,19.47 22.72,21.01 C11.1 | 17.7,47.76 17.7,47.7 SJ3.2 | U5.6 21.25,47.26 v20.9,47.61 | v18.65,47.81 18.6,47.76 17.7,47.76 | R7.1 17.05,52.21 17.05,52.01 17.7,51.36 17.7,47.76 | R7.1 16.25,53.01 | Q2.3 13.5,54.01 13.65,53.86 15.05,53.86 15.95,52.96 16.3,52.96 R7.1
  Top 0.203: SJ3.2 17.46,45.34 17.1,44.98
  Bottom 0.2: v20.9,47.61 18.85,47.61 v18.65,47.81
SND  (via drill 0.35)
  Top 0.2: 48.25,9.71 P1.31 | v46.6,10.66 45.29,10.66 44.75,11.2
  Top 0.203: v48.1,10.66 48.25,10.66 | 48.25,10.66 48.25,9.71 | R8.2 48.25,14.16 48.25,10.66 | U1.44 44.75,11.2
  Bottom 0.2: v48.1,10.66 v46.6,10.66
VBAT  (via drill 0.35)
  Top 0.203: U5.10 23.25,46.81 23.35,46.91 23.9,46.91 v24,47.01
  Top 0.4: R1.1 24.65,54.39 24.49,54.55 24.49,56.27 24.68,56.46 v24.8,56.46
  Top 0.5: v4.05,56.51 4.1,56.47 U4.4
  Bottom 0.4: v24.8,56.46 24.75,56.51 TP2.TP | v4.05,56.51 TP2.TP | v24,47.01 24,47.04 23.24,47.8 23.24,49.52 21.34,51.42 21.34,54.35 TP2.TP
VCC  (via drill 0.35)
  Top 0.203: v48.05,18.76 48.15,18.66 48.15,16.21 R8.1 | 40.25,29.31 41,29.31 | 41,29.31 41.25,29.31 | 41,29.31 41,20.66 | 41,20.66 v40.75,20.41 | 23.5,60.01 29,60.01 32,57.01 32,56.01 | 22.55,53.46 22.75,53.26 U5.2 | R9.1 22.2,54.36 v22.4,54.16 | U1.37 41.25,14.76 41,15.01 41,20.66
  Top 0.4: C7.1 10.7,48.21
  Top 0.5: 3,10.01 2,11.01 2,44.01 | 2,59.01 3,60.01 23.5,60.01
  Top 1.5: P1.1 3,10.01
  Bottom 0.203: v48.05,18.76 42.4,18.76 v40.75,20.41 | TP5.TP 26.75,55.76 v25.45,55.76
  Bottom 0.4: v22.4,54.16 22.4,54.61 23.29,55.5 25.19,55.5 v25.45,55.76
  other vias: 49,39.51 49.25,38.61 48.05,31.36 48.05,32.31 40.75,30.91 40.75,29.91
  pour Top (rank 3): 3.7,0.91 3.7,10.76 3.05,11.41 3.05,37.06 6.3,40.31 6.3,45.11 11.3,45.11 11.3,51.71 7.2,51.71 7.2,48.71 3.65,48.71 3.65,56.96 16.45,56.96 19.05,54.36 25.35,54.36 25.35,52.91 42.1,52.91 46.7,48.31 46.7,35.61 52.3,35.61 52.3,61.71 52,62.01 1,62.01 0,61.01 0,2.01 1.1,0.91
  pour Top: 40.25,32.46 40.25,17.26 40.6,16.91 40.6,13.31 41.25,13.31 41.25,32.46
  pour Top: 20.9,54.51 20.9,52.21 22.7,52.21 22.7,50.26 22.8,50.26 22.8,54.51
  pour Bottom: 48.82,39.81 49.15,39.81 49.55,39.41 49.55,38.46 48.9,37.81 48.9,31.76 46.7,29.56 40.25,29.56 40.25,30.86 42.75,33.36 47.7,33.36 47.7,38.65
  pour Top: 47,33.01 48.9,33.01 48.9,30.01 47,30.01
VCC_SRAM  (via drill 0.35)
  Top 0.203: 25.14,27.86 C5.1 | 27.5,48.51 28.15,47.86
  Bottom 0.203: TP1.TP 23.5,54.64 v23.54,54.69
  other vias: 17.95,57.31 16.95,57.31 5.35,46.91 4.4,46.91
  pour Top (rank 2): 16.5,54.26 16.5,57.61 18.25,57.61 18.25,56.61 24.1,56.61 24.1,52.76 31.8,52.76 31.8,40.41 28.7,40.41 28.7,36.66 25.45,36.66 25.45,27.41 20.25,27.41 20.25,31.01 20.9,31.66 24,31.66 24,47.41 23.1,47.41 23.1,54.26
  pour Top (rank 2): 5.75,46.51 5.75,48.86 4.05,48.86 4.05,46.51
  pour Bottom: 5.75,46.51 2.7,46.51 2.7,57.81 18.25,57.81 18.25,56.61 3.4,56.61 3.4,47.36 5.75,47.36

### Text on the board
tPlace: 64K | SW1 | RAM SIZE | 256K
tNames: + | U4 | CR2032 | MBC1 | CR2025 | _ | EEPROM | SRAM | 29F016 / 29F032 / 29F033 | 62256 / 6264
tStop: GAME BOY MBC1 CARTRIDGE | 1 | 32
bStop: v1.4 | www.mousebitelabs.com | SUPPORT ORIGINAL CREATORS!
200bmp: C:/Users/Nick/Documents/EAGLE9/projects/534-5344571_open-source-hardware-open-source-hardware-logo-png.bmp | C:/Users/Nick/Documents/EAGLE9/projects/534-5344571_open-source-hardware-open-source-hardware-logo-png.bmp